# EAGLE board MotherboardRev2 (EAGLE 7.2.0)
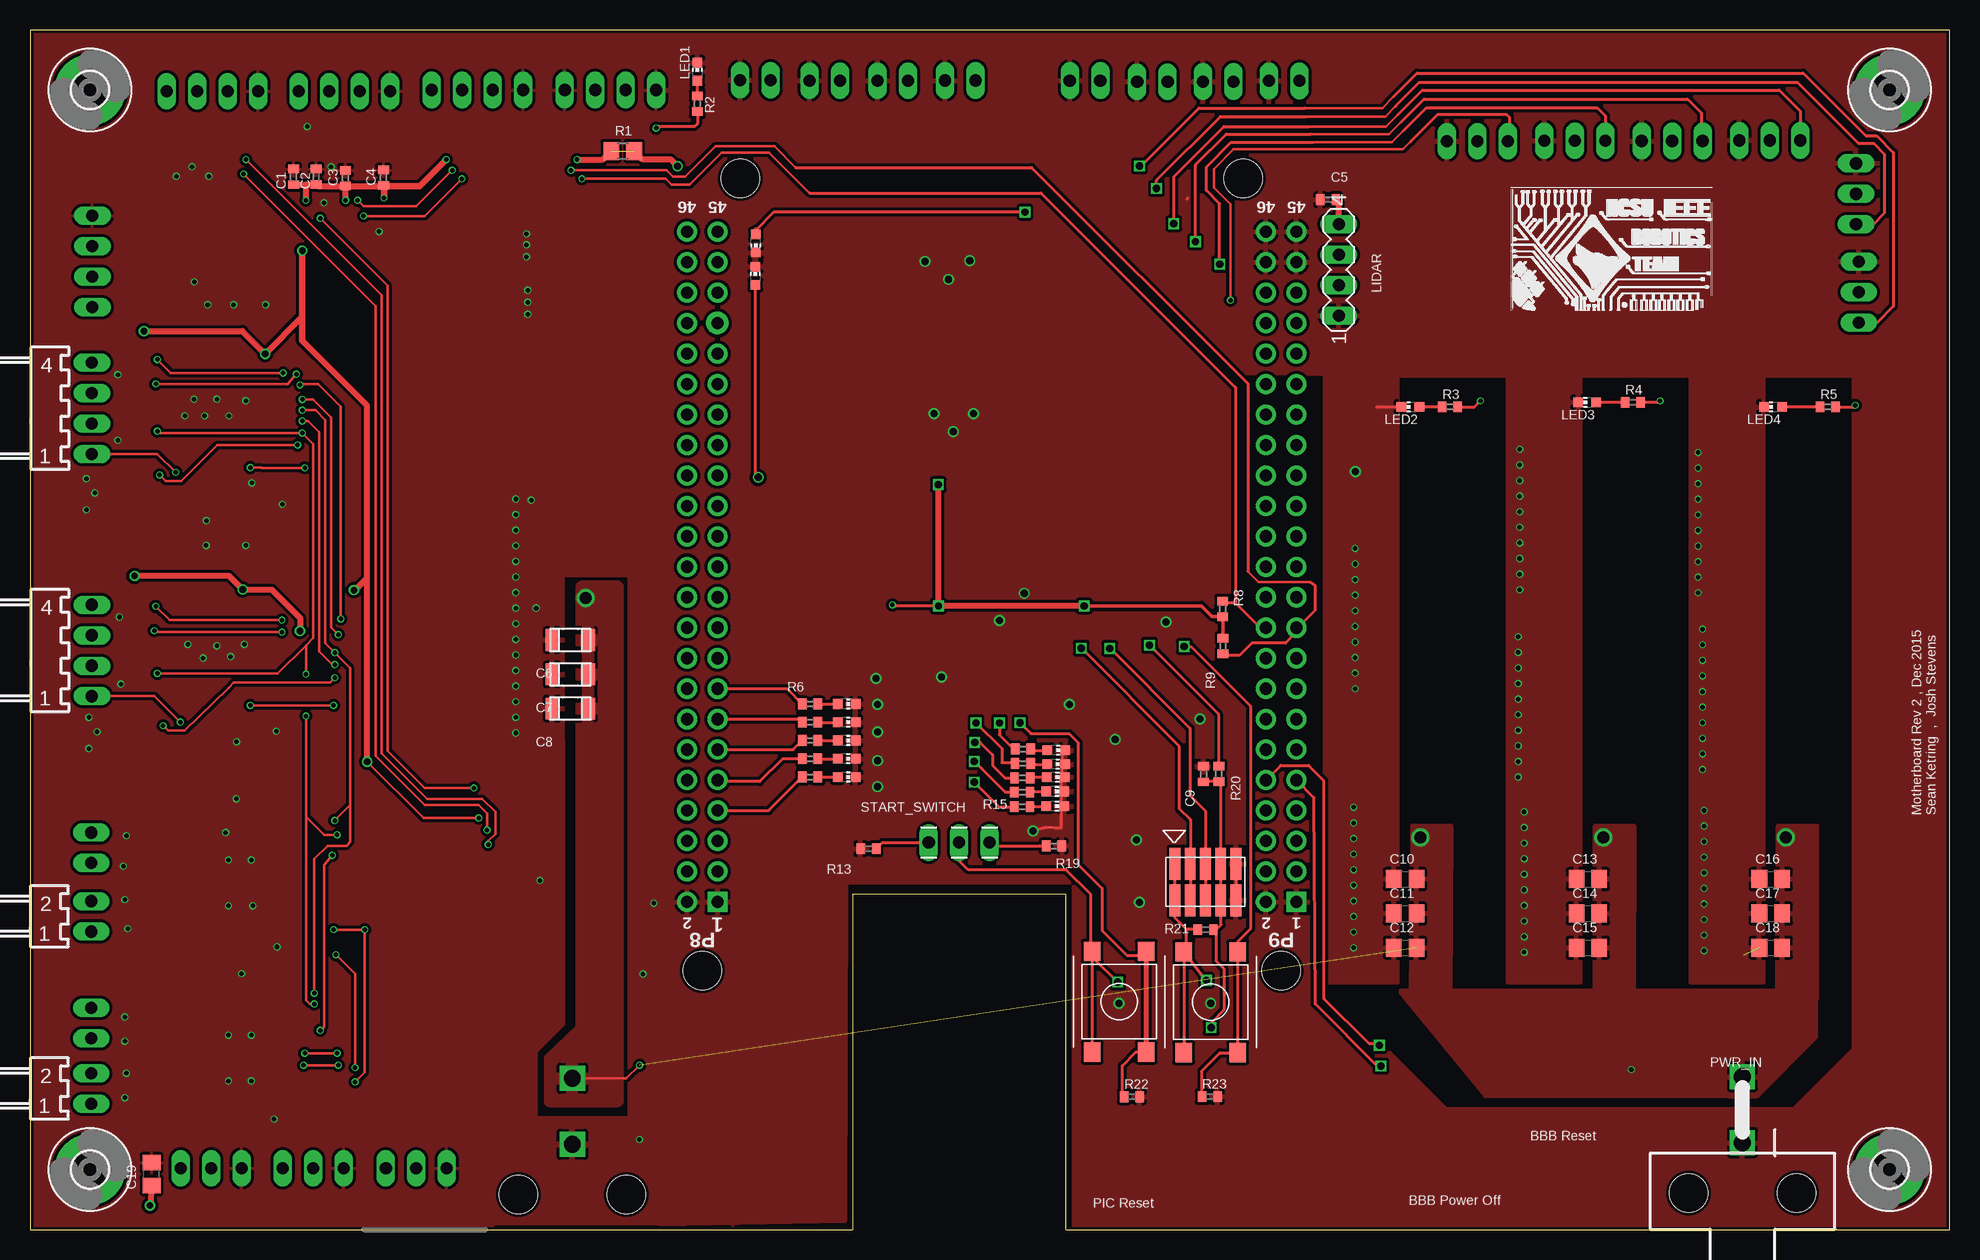
[diagram p12: board, top side]
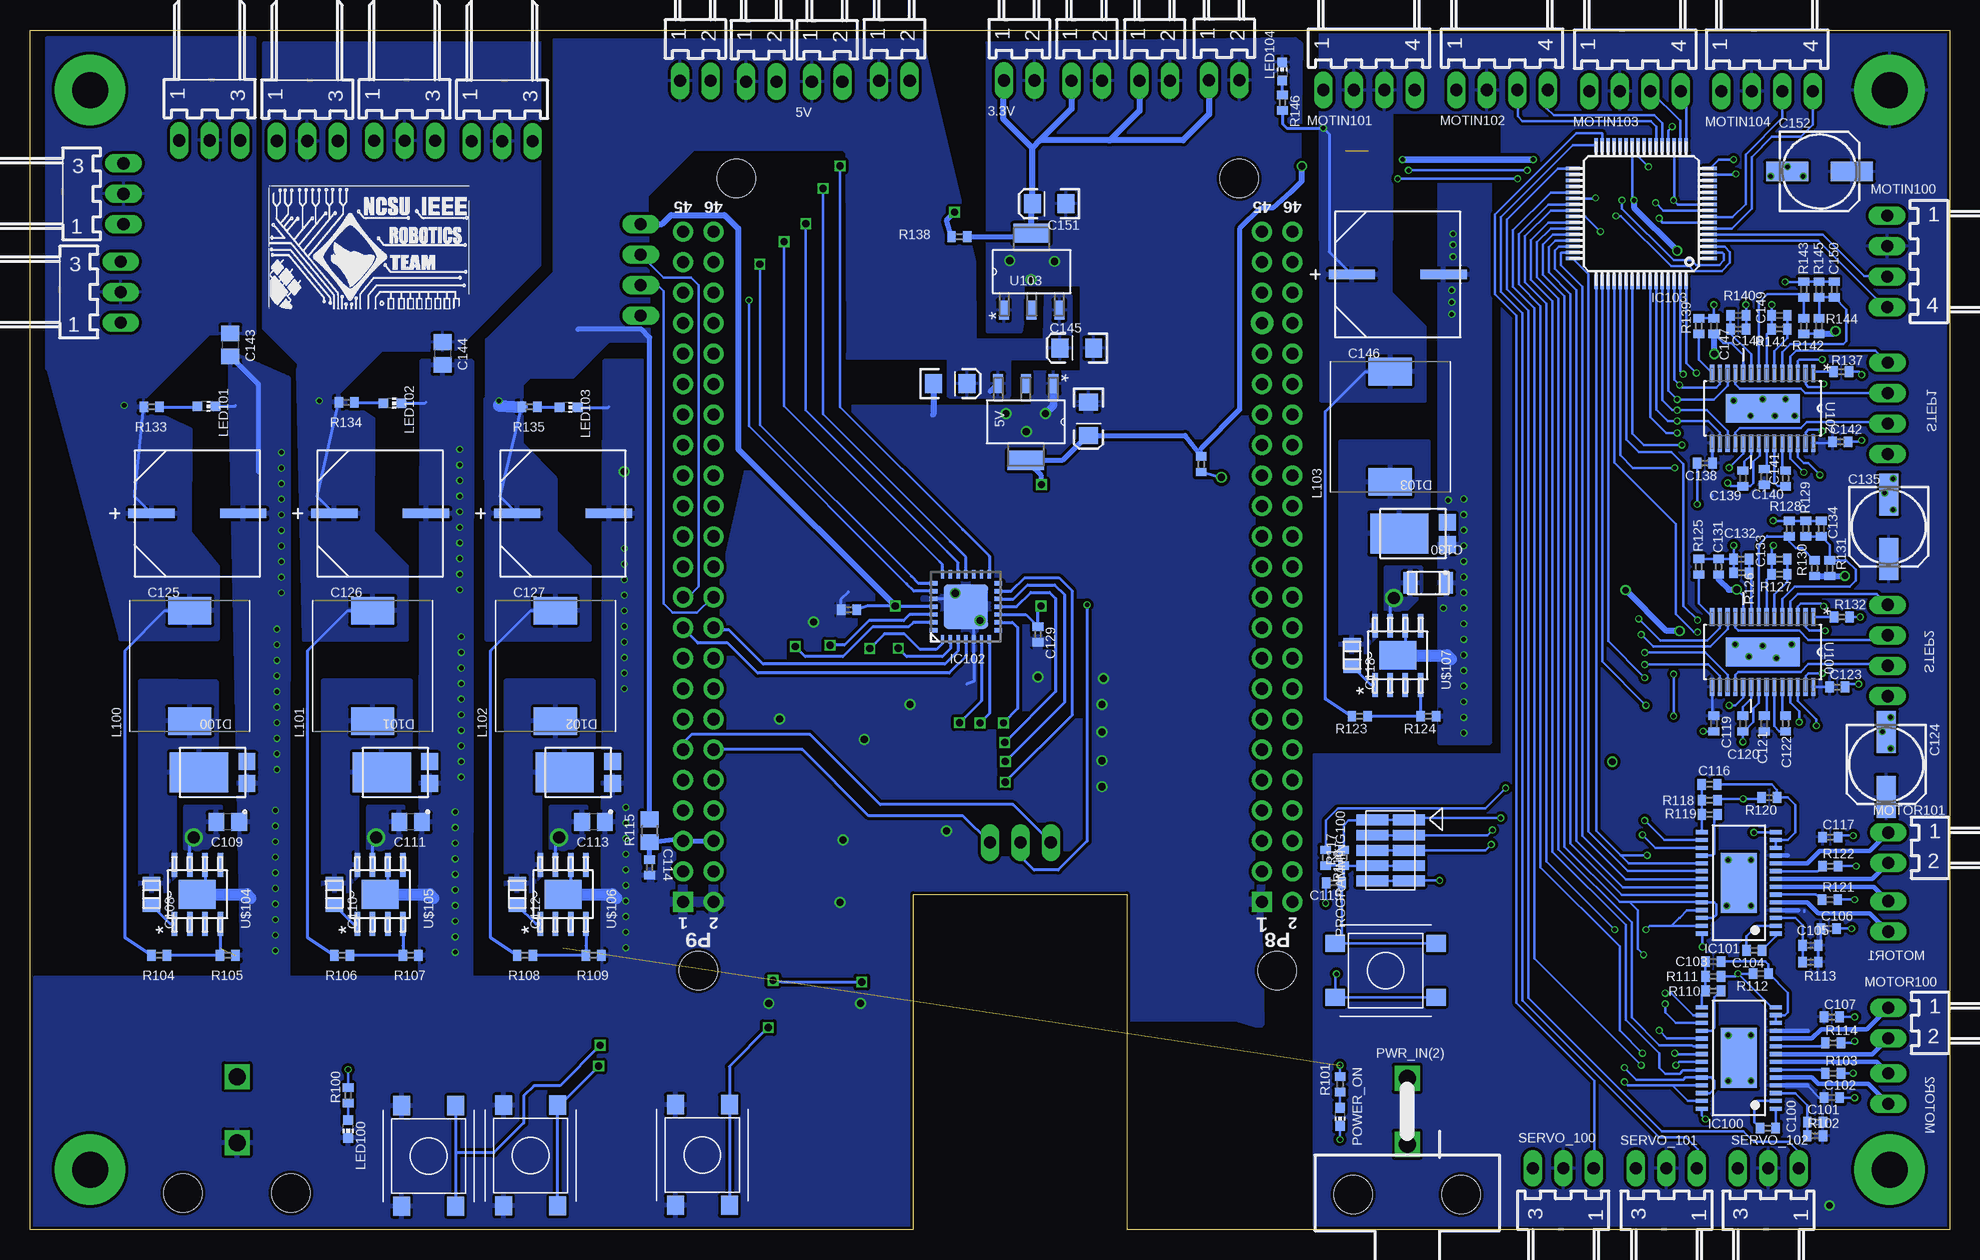
[diagram p13: board, bottom side, seen from below]

Size 160 x 100 mm. Coordinates in mm from the lower left corner, seen from the top.
Outline: 86.36,0 160,0 160,100 0,100 0,0 68.58,0 68.58,27.94 86.36,27.94 86.36,0
Copper layers (1*16): Top 0.035mm / dielectric 1.5mm / Bottom 0.035mm
Design rules "EagleRules-2-Layer-Shep *": minimum track width 6mil, minimum drill 12mil, track to track 6mil, track to pad 6mil, pad to pad 6mil, via to via 6mil, smd to smd 0mil, copper to edge 10mil, drill to drill 10mil, minimum pad ring 2mil, minimum via ring 2mil, stop-mask expansion 2mil, vias tented up to drill 100mil, thermal gap 10mil
Net classes: 0 default: width 0.203 mm, drill 0.33 mm, clearance 0.254 mm; 1 +3v3: width 0.406 mm, drill 0.457 mm, clearance 0.254 mm; 2 VM: width 0.508 mm, drill 0.533 mm, clearance 0.254 mm

## Footprints (pad centres in the part's own frame; a part is rotated, then mirrored left to right if it is on the bottom)
7395-02 = drill 1.016 long: 1 1.27,0; 2 -1.27,0
C0402 = smd 0.7 x 0.9: 1 -0.65,0; 2 0.65,0
1206 = smd 1.118 x 1.803: 1 -1.499,0; 2 1.499,0
C0805 = smd 1.3 x 1.5: 1 -0.95,0; 2 0.95,0
0805 = smd 1.118 x 1.448: 1 -0.902,0; 2 0.902,0
153CLV-0605 = smd 3.5 x 1.6: + 2.7,0; - -2.7,0
SM_RADIAL_10AMM = smd 3.861 x 0.787: 1 -3.823,0; 2 3.823,0
EIA3216 = smd 1.4 x 1.6: A 1.4,0; C -1.4,0
CHIP-LED0603 = smd 0.8 x 0.8: A 0,-0.75; C 0,0.75
POWERDI5 = smd 1.397 x 1.397: 1 -0.92,-2.857; 2 0.92,-2.857 | smd 3.353 x 4.851: 3 0,1.13
3,0-PAD = drill 3 pad 5.842: B3,0 0,0
TSSOP-28 = smd 0.35 x 1: 1 -4.225,-3.087; 2 -3.575,-3.087; 3 -2.925,-3.087; 4 -2.275,-3.087; 5 -1.625,-3.087; 6 -0.975,-3.087; 7 -0.325,-3.087; 8 0.325,-3.087; 9 0.975,-3.087; 10 1.625,-3.087; 11 2.275,-3.087; 12 2.925,-3.087; 13 3.575,-3.087; 14 4.225,-3.087; 15 4.225,3.087; 16 3.575,3.087; 17 2.925,3.087; 18 2.275,3.087; 19 1.625,3.087; 20 0.975,3.087; 21 0.325,3.087; 22 -0.325,3.087; 23 -0.975,3.087; 24 -1.625,3.087; 25 -2.275,3.087; 26 -2.925,3.087; 27 -3.575,3.087; 28 -4.225,3.087 | smd 5 x 3: EXP 0,0
QFN28-ML_6X6MM = smd 0.7 x 0.35: 1 -2.7,1.95; 2 -2.7,1.3; 3 -2.7,0.65; 4 -2.7,0; 5 -2.7,-0.65; 6 -2.7,-1.3; 7 -2.7,-1.95; 15 2.7,-1.95; 16 2.7,-1.3; 17 2.7,-0.65; 18 2.7,0; 19 2.7,0.65; 20 2.7,1.3; 21 2.7,1.95 | smd 0.35 x 0.7: 8 -1.95,-2.7; 9 -1.3,-2.7; 10 -0.65,-2.7; 11 0,-2.7; 12 0.65,-2.7; 13 1.3,-2.7; 14 1.95,-2.7; 22 1.95,2.7; 23 1.3,2.7; 24 0.65,2.7; 25 0,2.7; 26 -0.65,2.7; 27 -1.3,2.7; 28 -1.95,2.7 | smd 3.7 x 3.7: EXP 0,0
TQFP64-10X10 = smd 1.2 x 0.3: 1 -5.7,3.75; 2 -5.7,3.25; 3 -5.7,2.75; 4 -5.7,2.25; 5 -5.7,1.75; 6 -5.7,1.25; 7 -5.7,0.75; 8 -5.7,0.25; 9 -5.7,-0.25; 10 -5.7,-0.75; 11 -5.7,-1.25; 12 -5.7,-1.75; 13 -5.7,-2.25; 14 -5.7,-2.75; 15 -5.7,-3.25; 16 -5.7,-3.75; 33 5.7,-3.75; 34 5.7,-3.25; 35 5.7,-2.75; 36 5.7,-2.25; 37 5.7,-1.75; 38 5.7,-1.25; 39 5.7,-0.75; 40 5.7,-0.25; 41 5.7,0.25; 42 5.7,0.75; 43 5.7,1.25; 44 5.7,1.75; 45 5.7,2.25; 46 5.7,2.75; 47 5.7,3.25; 48 5.7,3.75 | smd 0.3 x 1.2: 17 -3.75,-5.7; 18 -3.25,-5.7; 19 -2.75,-5.7; 20 -2.25,-5.7; 21 -1.75,-5.7; 22 -1.25,-5.7; 23 -0.75,-5.7; 24 -0.25,-5.7; 25 0.25,-5.7; 26 0.75,-5.7; 27 1.25,-5.7; 28 1.75,-5.7; 29 2.25,-5.7; 30 2.75,-5.7; 31 3.25,-5.7; 32 3.75,-5.7; 49 3.75,5.7; 50 3.25,5.7; 51 2.75,5.7; 52 2.25,5.7; 53 1.75,5.7; 54 1.25,5.7; 55 0.75,5.7; 56 0.25,5.7; 57 -0.25,5.7; 58 -0.75,5.7; 59 -1.25,5.7; 60 -1.75,5.7; 61 -2.25,5.7; 62 -2.75,5.7; 63 -3.25,5.7; 64 -3.75,5.7
WE-HCC_1090 = smd 2.3 x 3.6: 1 -4.6,0; 2 4.6,0
MA04-1 = drill 1.016 long: 1 -3.81,0; 2 -1.27,0; 3 1.27,0; 4 3.81,0
7395-04 = drill 1.016 long: 1 3.81,0; 2 1.27,0; 3 -1.27,0; 4 -3.81,0
MOTHER-BOARD-REV5_10-PIN-SMD = smd 0.889 x 2.667: 1 -2.54,1.524; 2 -2.54,-1.524; 3 -1.27,1.524; 4 -1.27,-1.524; 5 0,1.524; 6 0,-1.524; 7 1.27,1.524; 8 1.27,-1.524; 9 2.54,1.524; 10 2.54,-1.524
5569-2 = drill 1.4 square: 1 0,0; 2 0,5.5 | hole 3.2: 4.5,-4.2; -4.5,-4.2
R0805 = smd 1.3 x 1.5: 1 -0.95,0; 2 0.95,0
R0402 = smd 0.7 x 0.9: 1 -0.65,0; 2 0.65,0
7395-03 = drill 1.016 long: 1 2.54,0; 2 0,0; 3 -2.54,0
MA03-1 = drill 1.016 long: 1 -2.54,0; 2 0,0; 3 2.54,0
SOP65P640X120-29N = smd 1.473 x 0.356: 1 -2.921,4.216; 2 -2.921,3.581; 3 -2.921,2.921; 4 -2.921,2.286; 5 -2.921,1.626; 6 -2.921,0.965; 7 -2.921,0.33; 8 -2.921,-0.33; 9 -2.921,-0.965; 10 -2.921,-1.626; 11 -2.921,-2.286; 12 -2.921,-2.921; 13 -2.921,-3.581; 14 -2.921,-4.216; 15 2.921,-4.216; 16 2.921,-3.581; 17 2.921,-2.921; 18 2.921,-2.286; 19 2.921,-1.626; 20 2.921,-0.965; 21 2.921,-0.33; 22 2.921,0.33; 23 2.921,0.965; 24 2.921,1.626; 25 2.921,2.286; 26 2.921,2.921; 27 2.921,3.581; 28 2.921,4.216 | smd 2.388 x 6.172: 29 0,0
SOT230P696X180-4N = smd 1.6 x 0.838: 1 -3.2,2.311; 2 -3.2,0; 3 -3.2,-2.311 | smd 1.6 x 3.023: 4 3.2,0
MC32882_FINAL = smd 1.6 x 1.4: P$1 -4.2,-2.25; P$2 -4.2,2.25; P$3 4.2,2.25; P$4 4.2,-2.25
BEAGLE_BONE_BLACK_CAPE = drill 1.016 pad 1.676 square: P8.1 20.32,50.165; P9.1 20.32,1.905 | drill 1.016 pad 1.676: P8.2 20.32,52.705; P8.3 22.86,50.165; P8.4 22.86,52.705; P8.5 25.4,50.165; P8.6 25.4,52.705; P8.7 27.94,50.165; P8.8 27.94,52.705; P8.9 30.48,50.165; P8.10 30.48,52.705; P8.11 33.02,50.165; P8.12 33.02,52.705; P8.13 35.56,50.165; P8.14 35.56,52.705; P8.15 38.1,50.165; P8.16 38.1,52.705; P8.17 40.64,50.165; P8.18 40.64,52.705; P8.19 43.18,50.165; P8.20 43.18,52.705; P8.21 45.72,50.165; P8.22 45.72,52.705; P8.23 48.26,50.165; P8.24 48.26,52.705; P8.25 50.8,50.165; P8.26 50.8,52.705; P8.27 53.34,50.165; P8.28 53.34,52.705; P8.29 55.88,50.165; P8.30 55.88,52.705; P8.31 58.42,50.165; P8.32 58.42,52.705; P8.33 60.96,50.165; P8.34 60.96,52.705; P8.35 63.5,50.165; P8.36 63.5,52.705; P8.37 66.04,50.165; P8.38 66.04,52.705; P8.40 68.58,52.705; P8.41 71.12,50.165; P8.42 71.12,52.705; P8.43 73.66,50.165; P8.44 73.66,52.705; P8.45 76.2,50.165; P8.46 76.2,52.705; P9.2 20.32,4.445; P9.3 22.86,1.905; P9.4 22.86,4.445; P9.5 25.4,1.905; P9.6 25.4,4.445; P9.7 27.94,1.905; P9.8 27.94,4.445; P9.9 30.48,1.905; P9.10 30.48,4.445; P9.11 33.02,1.905; P9.12 33.02,4.445; P9.13 35.56,1.905; P9.14 35.56,4.445; P9.15 38.1,1.905; P9.16 38.1,4.445; P9.17 40.64,1.905; P9.18 40.64,4.445; P9.19 43.18,1.905; P9.20 43.18,4.445; P9.21 45.72,1.905; P9.22 45.72,4.445; P9.23 48.26,1.905; P9.24 48.26,4.445; P9.25 50.8,1.905; P9.26 50.8,4.445; P9.27 53.34,1.905; P9.28 53.34,4.445; P9.29 55.88,1.905; P9.30 55.88,4.445; P9.31 58.42,1.905; P9.32 58.42,4.445; P9.33 60.96,1.905; P9.34 60.96,4.445; P9.35 63.5,1.905; P9.36 63.5,4.445; P9.37 66.04,1.905; P9.38 66.04,4.445; P9.39 68.58,1.905; P9.40 68.58,4.445; P9.41 71.12,1.905; P9.42 71.12,4.445; P9.43 73.66,1.905; P9.44 73.66,4.445; P9.45 76.2,1.905; P9.46 76.2,4.445 | drill 1.016 pad 1.88: P8.39 68.58,50.165 | hole 3.175: 14.605,3.175; 80.645,6.35; 80.645,48.26; 14.605,51.435
R-PDSO-G8 = smd 1.981 x 0.457: 1 -2.464,1.905; 2 -2.464,0.635; 3 -2.464,-0.635; 4 -2.464,-1.905; 5 2.464,-1.905; 6 2.464,-0.635; 7 2.464,0.635; 8 2.464,1.905 | smd 2.388 x 3.099: 9 0,0

## Placement (x,y rotation side)
3.3V  [7395-02]  77.54,95.79 180 bottom
3.3V1  [7395-02]  66.25,95.77 180 bottom
3.3V(2)  [7395-02]  71.91,95.77 180 bottom
3.3V(2)1  [7395-02]  60.45,95.81 180 bottom
5V  [7395-02]  93.56,95.68 180 bottom
5V1  [7395-02]  99.04,95.7 180 bottom
5V(2)  [7395-02]  87.94,95.78 180 bottom
5V(2)1  [7395-02]  104.53,95.76 180 bottom
C1  0.1uF  [C0402]  21.97,87.76 90 top
C2  0.1uF  [C0402]  23.86,87.76 90 top
C3  1uF  [C0402]  26.3,87.65 90 top
C4  0.1uF  [C0402]  29.47,87.68 90 top
C5  4.7uF  [C0402]  108.2,85.85 180 top
C6  4.7uF  [1206]  45.04,49.14 0 top
C7  4.7uF  [1206]  45.04,46.28 0 top
C8  4.7uF  [1206]  45.04,43.42 0 top
C9  .1uF  [C0402]  97.82,37.96 90 top
C10  4.7uF  [C0805]  114.62,29.21 0 top
C11  4.7uF  [C0805]  114.62,26.35 0 top
C12  4.7uF  [C0805]  114.62,23.5 0 top
C13  4.7uF  [C0805]  129.86,29.21 0 top
C14  4.7uF  [C0805]  129.86,26.35 0 top
C15  4.7uF  [C0805]  129.86,23.5 0 top
C16  4.7uF  [C0805]  145.1,29.21 0 top
C17  4.7uF  [C0805]  145.1,26.35 0 top
C18  4.7uF  [C0805]  145.1,23.5 0 top
C19  10uF  [C0805]  10.13,4.63 90 top
C100  0.01uF  [C0402]  15.14,8.45 180 bottom
C101  0.1uF  [C0402]  11.2,8.96 0 bottom
C102  0.01uF  [C0402]  9.81,10.99 0 bottom
C103  0.47uF  [C0402]  19.7,21.1 0 bottom
C104  0.01uF  [C0402]  16.28,23.28 180 bottom
C105  0.1uF  [C0402]  11.58,23.69 0 bottom
C106  0.01uF  [C0402]  10.06,25.09 0 bottom
C107  0.01uF  [C0402]  9.81,17.72 0 bottom
C108  10nF  [0805]  149.86,27.94 90 bottom
C109  4.7uF  [C0805]  143.51,33.97 180 bottom
C110  10nF  [0805]  134.62,27.94 90 bottom
C111  4.7uF  [C0805]  128.27,33.97 180 bottom
C112  10nF  [0805]  119.38,27.94 90 bottom
C113  4.7uF  [C0805]  113.03,33.97 180 bottom
C114  .1uF  [C0402]  108.35,30.18 270 bottom
C115  .1uF  [C0402]  51.3,28.9 180 bottom
C116  0.47uF  [C0402]  20,35.8 0 bottom
C117  0.01uF  [C0402]  9.93,32.71 0 bottom
C118  10nF  [0805]  49.8,47.87 90 bottom
C119  0.1uF  [C0402]  19.64,42.17 270 bottom
C120  0.22uF  [C0402]  17.22,42.17 270 bottom
C121  0.22uF  [C0402]  15.45,42.17 90 bottom
C122  0.22uF  [C0402]  13.67,42.17 90 bottom
C123  0.1uF  [C0402]  9.35,45.22 0 bottom
C124  100uf  [153CLV-0605]  5.27,38.76 270 bottom
C125  330uF  [SM_RADIAL_10AMM]  146.05,59.69 0 bottom
C126  330uF  [SM_RADIAL_10AMM]  130.81,59.69 0 bottom
C127  330uF  [SM_RADIAL_10AMM]  115.57,59.69 0 bottom
C128  .1uF  [C0402]  91.73,51.67 180 bottom
C129  .1uF  [C0402]  75.98,49.61 270 bottom
C130  4.7uF  [1206]  43.45,53.9 180 bottom
C131  0.1uF  [C0402]  19.25,55.26 90 bottom
C132  1nF  [C0402]  17.35,55.89 180 bottom
C133  1nF  [C0402]  14.18,55.89 180 bottom
C134  .1uF  [C0402]  10.69,58.43 90 bottom
C135  100uf  [153CLV-0605]  5.06,58.58 270 bottom
C136  10uF  [EIA3216]  83.29,70.51 0 bottom
C137  10uF  [EIA3216]  71.77,67.59 270 bottom
C138  0.1uF  [C0402]  20.4,63.89 180 bottom
C139  0.22uF  [C0402]  17.22,62.62 270 bottom
C140  0.22uF  [C0402]  15.45,62.75 90 bottom
C141  0.22uF  [C0402]  13.67,62.62 90 bottom
C142  0.1uF  [C0402]  9.1,65.67 0 bottom
C143  10uF  [C0805]  143.31,73.76 270 bottom
C144  10uF  [C0805]  125.61,73.03 270 bottom
C145  10uF  [EIA3216]  72.74,73.49 180 bottom
C146  330uF  [SM_RADIAL_10AMM]  45.99,79.62 0 bottom
C147  0.1uF  [C0402]  19.64,75.32 90 bottom
C148  1nF  [C0402]  17.6,75.07 0 bottom
C149  1nF  [C0402]  14.18,76.21 180 bottom
C150  0.1uF  [C0402]  9.6,78.37 90 bottom
C151  10uF  [EIA3216]  75.05,85.52 180 bottom
C152  100uf  [153CLV-0605]  10.84,88.2 0 bottom
D1  3_3V_PWR  [CHIP-LED0603]  60.5,82.19 180 top
D2  3_3V_PWR  [CHIP-LED0603]  60.45,79.5 0 top
D100  PDS760-13  [POWERDI5]  144.78,38.1 90 bottom
D101  PDS760-13  [POWERDI5]  129.54,38.1 90 bottom
D102  PDS760-13  [POWERDI5]  114.3,38.1 90 bottom
D103  PDS760-13  [POWERDI5]  44.72,58.03 90 bottom
H1  MOUNT-PAD-ROUND3.0  [3,0-PAD]  5,95 0 top
H2  MOUNT-PAD-ROUND3.0  [3,0-PAD]  155,95 0 top
H3  MOUNT-PAD-ROUND3.0  [3,0-PAD]  5,5 0 top
H4  MOUNT-PAD-ROUND3.0  [3,0-PAD]  155,5 0 top
IC100  DRV8814  [TSSOP-28]  17.55,14.29 90 bottom
IC101  DRV8814  [TSSOP-28]  17.55,28.9 90 bottom
IC102  PIC24FJ64GB202  [QFN28-ML_6X6MM]  81.99,51.92 90 bottom
IC103  PIC24FJ256GB106  [TQFP64-10X10]  25.7,84.7 180 bottom
L100  [WE-HCC_1090]  146.69,46.99 90 bottom
L101  [WE-HCC_1090]  131.44,46.99 90 bottom
L102  [WE-HCC_1090]  116.2,46.99 90 bottom
L103  [WE-HCC_1090]  46.62,66.92 90 bottom
LED1  [CHIP-LED0603]  55.63,96.52 0 top
LED2  [CHIP-LED0603]  115.06,68.58 90 top
LED3  [CHIP-LED0603]  129.79,68.96 90 top
LED4  [CHIP-LED0603]  145.29,68.58 90 top
LED5  [CHIP-LED0603]  68.07,43.81 270 top
LED6  [CHIP-LED0603]  68.07,42.29 270 top
LED7  [CHIP-LED0603]  68.07,40.77 270 top
LED8  [CHIP-LED0603]  68.07,39.24 270 top
LED9  [CHIP-LED0603]  68.07,37.72 270 top
LED10  [CHIP-LED0603]  85.46,35.28 270 top
LED11  [CHIP-LED0603]  85.46,36.52 270 top
LED12  [CHIP-LED0603]  85.5,37.71 270 top
LED13  [CHIP-LED0603]  85.53,38.79 270 top
LED14  [CHIP-LED0603]  85.56,39.96 270 top
LED100  [CHIP-LED0603]  133.48,8.38 180 bottom
LED101  [CHIP-LED0603]  145.28,68.63 270 bottom
LED102  [CHIP-LED0603]  129.79,68.89 270 bottom
LED103  [CHIP-LED0603]  115.1,68.54 270 bottom
LED104  [CHIP-LED0603]  55.62,96.56 0 bottom
LIDAR  [MA04-1]  109.09,80.01 90 top
MOTIN100  22-05-7048-04  [7395-04]  5.2,80.7 90 bottom
MOTIN101  22-05-7048-04  [7395-04]  48.39,95 180 bottom
MOTIN102  22-05-7048-04  [7395-04]  37.3,95 180 bottom
MOTIN103  22-05-7048-04  [7395-04]  26.2,94.9 180 bottom
MOTIN104  22-05-7048-04  [7395-04]  15.2,94.9 180 bottom
MOTOR1  22-05-7028-02  [7395-02]  5.11,26.11 270 top
MOTOR2  22-05-7028-02  [7395-02]  5.11,11.75 270 top
MOTOR100  22-05-7028-02  [7395-02]  5.11,17.21 90 bottom
MOTOR101  22-05-7028-02  [7395-02]  5.11,31.82 90 bottom
POWER_ON  [CHIP-LED0603]  50.8,9.4 180 bottom
PROGRAMMING  Jtag  [MOTHER-BOARD-REV5_10-PIN-SMD]  97.98,28.97 0 top
PROGRAMMING100  Jtag  [MOTHER-BOARD-REV5_10-PIN-SMD]  46.6,31.6 270 bottom
PWR_IN  [5569-2]  142.74,7.24 0 top
PWR_IN(2)  [5569-2]  45.2,7.1 0 bottom
R1  0  [R0805]  49.4,89.92 0 top
R2  10k  [R0402]  55.63,93.85 270 top
R3  10k  [R0402]  118.36,68.58 0 top
R4  10k  [R0402]  133.6,68.96 0 top
R5  10k  [R0402]  149.86,68.58 0 top
R6  1K  [R0402]  65.02,43.81 180 top
R7  1K  [R0402]  65.02,42.29 180 top
R8  4.7K  [R0402]  99.41,51.74 270 top
R9  4.7K  [R0402]  99.44,48.64 90 top
R10  1K  [R0402]  65.02,40.77 180 top
R11  1K  [R0402]  65.02,39.24 180 top
R12  1K  [R0402]  65.02,37.72 180 top
R13  10K  [R0402]  69.89,31.75 0 top
R14  330  [R0402]  82.7,36.46 180 top
R15  330  [R0402]  82.71,35.25 180 top
R16  330  [R0402]  82.71,37.65 180 top
R17  330  [R0402]  82.76,38.86 180 top
R18  330  [R0402]  82.77,40.05 180 top
R19  10K  [R0402]  85.35,31.97 180 top
R20  100  [R0402]  99.1,37.98 270 top
R21  10k  [R0402]  98,25 180 top
R22  10K  [R0402]  91.85,11.07 0 top
R23  10K  [R0402]  98.34,11.09 0 top
R100  10k  [R0402]  133.48,11.18 90 bottom
R101  10k  [R0402]  50.8,12.1 90 bottom
R102  1M  [R0402]  11.2,7.82 0 bottom
R103  0.2  [R0402]  9.71,13.02 0 bottom
R104  10k  [R0402]  149.22,22.86 180 bottom
R105  2.55k  [R0402]  143.51,22.86 180 bottom
R106  10k  [R0402]  133.99,22.86 180 bottom
R107  2.55k  [R0402]  128.27,22.86 180 bottom
R108  10k  [R0402]  118.75,22.86 180 bottom
R109  3.23K  [R0402]  113.03,22.86 180 bottom
R110  10k  [R0402]  19.7,19.9 180 bottom
R111  10k  [R0402]  19.69,22.34 180 bottom
R112  30k  [R0402]  15.73,21.34 180 bottom
R113  1M  [R0402]  11.58,22.3 0 bottom
R114  0.2  [R0402]  9.71,15.56 0 bottom
R115  0 ohm  [R0805]  108.34,33.24 90 bottom
R116  100  [R0402]  52,31 270 bottom
R117  10k  [R0402]  50.5,31 90 bottom
R118  10k  [R0402]  20,37.11 180 bottom
R119  10k  [R0402]  20,34.6 180 bottom
R120  30k  [R0402]  15.01,36.01 180 bottom
R121  0.2  [R0402]  9.96,27.5 0 bottom
R122  0.2  [R0402]  9.93,30.3 0 bottom
R123  10k  [R0402]  49.16,42.79 180 bottom
R124  2.55k  [R0402]  43.45,42.79 180 bottom
R125  0.1  [R0402]  20.91,55.26 90 bottom
R126  47k  [R0402]  17.35,54.75 180 bottom
R127  47k  [R0402]  14.18,54.62 180 bottom
R128  10k  [R0402]  13.35,58.43 90 bottom
R129  10k  [R0402]  11.98,58.43 90 bottom
R130  10k  [R0402]  11.25,55.13 90 bottom
R131  10k  [R0402]  9.98,55.13 90 bottom
R132  0.1  [R0402]  8.97,51.06 0 bottom
R133  10k  [R0402]  149.86,68.58 180 bottom
R134  10k  [R0402]  133.6,68.96 180 bottom
R135  10k  [R0402]  118.36,68.58 180 bottom
R136  330  [R0402]  62.37,63.79 270 bottom
R137  0.1  [R0402]  9.02,71.51 0 bottom
R138  330  [R0402]  82.54,82.76 180 bottom
R139  0.1  [R0402]  20.91,75.32 90 bottom
R140  47k  [R0402]  17.6,76.21 0 bottom
R141  47k  [R0402]  14.18,75.07 180 bottom
R142  10k  [R0402]  12.14,75.32 90 bottom
R143  10k  [R0402]  12.14,78.37 90 bottom
R144  10k  [R0402]  10.87,75.32 90 bottom
R145  10k  [R0402]  10.87,78.37 90 bottom
R146  10k  [R0402]  55.6,93.94 270 bottom
SERVO_100  [7395-03]  32.2,5.1 0 bottom
SERVO_101  [7395-03]  23.6,5.1 0 bottom
SERVO_102  [7395-03]  15.1,5.1 0 bottom
SERVO_103  [7395-03]  152.45,78.16 270 bottom
SERVO_104  [7395-03]  152.21,86.34 270 bottom
SERVO_105  [7395-03]  145.03,90.79 180 bottom
SERVO_106  [7395-03]  136.88,90.74 180 bottom
SERVO_107  [7395-03]  128.78,90.76 180 bottom
SERVO_108  [7395-03]  120.65,90.72 180 bottom
START_SWITCH  [MA03-1]  77.45,32.26 0 top
STEP1  22-05-7048-04  [7395-04]  5.16,68.46 270 top
STEP2  22-05-7048-04  [7395-04]  5.16,48.27 270 top
U100  DRV8811PWP  [SOP65P640X120-29N]  15.57,48.14 270 bottom
U101  LMS8117AMP-3.3  [SOT230P696X180-4N]  76.99,67.33 270 bottom
U102  DRV8811PWP  [SOP65P640X120-29N]  15.57,68.46 270 bottom
U103  LMS8117AMP-3.3  [SOT230P696X180-4N]  76.51,79.85 90 bottom
U$1  LOGO  [LOGO]  130.56,80.9 0 top
U$2  LOGO  [LOGO]  130.68,80.9 0 top
U$3  Switch2  [MC32882_FINAL]  90.79,18.99 270 top
U$4  Switch1  [MC32882_FINAL]  98.42,18.94 270 top
U$5  BEAGLE_BONE_BLACK_CAPE  [BEAGLE_BONE_BLACK_CAPE]  107.47,6.99 90 top
U$100  Switch1  [MC32882_FINAL]  126.77,6.13 270 bottom
U$101  Switch1  [MC32882_FINAL]  118.27,6.17 270 bottom
U$102  Switch3  [MC32882_FINAL]  103.95,6.21 270 bottom
U$103  Switch3  [MC32882_FINAL]  47,21.6 0 bottom
U$104  TPS5450DDAR  [R-PDSO-G8]  146.05,27.94 90 bottom
U$105  TPS5450DDAR  [R-PDSO-G8]  130.81,27.94 90 bottom
U$106  TPS5450DDAR  [R-PDSO-G8]  115.57,27.94 90 bottom
U$107  TPS5450DDAR  [R-PDSO-G8]  45.99,47.87 90 bottom
U$108  LOGO  [LOGO]  132.97,81.03 0 bottom

## Tracks (layer width: path | path; a pad name or v marks a point on that pad's centre or on a via)
3.3V  (via drill 0.38, 0.56, 0.6)  (1 unrouted)
  Top 0.203: v28.1,39 32.8,34.3 v37.4,34.3 | C3.1 | 29.5,87 C4.1
  Top 0.254: PROGRAMMING.1 PROGRAMMING.2 95.44,25.96 96.4,25 | U$4.P$1 U$4.P$4 | 88.54,22.5 U$3.P$1 88.43,23.3 88.43,27.93 86.36,30 78.19,30 77.45,30.74 START_SWITCH.2 | 88.54,22.5 U$3.P$4 | 75.65,51.98 v75.72,51.98 71.97,51.98 v71.88,52.07 | R21.2 96.4,25 | U$4.P$1 97.77,21.11 v98.06,20.77 | v90.66,20.63 88.79,22.5 88.54,22.5 | U$4.P$1 96.4,23.37 96.4,25
  Top 0.305: R9.2 99.44,51.06 R8.2 99.39,51.11 98.51,51.11 97.64,51.98 v87.87,51.98
  Top 0.406: 75.72,62.09 v75.7,62.11
  Top 0.508: v87.87,51.98 v75.72,51.98 75.72,62.09 | v9.5,74.9 17.7,74.9 v19.6,73 | v28.1,39 28.1,54.3 | 28.1,54.3 28.1,68.7 23.8,73 | v22.5,49.9 22.5,51 20.15,53.35 v17.73,53.35 16.59,54.49 v8.71,54.49 | v27,53.3 27.1,53.3 28.1,54.3 | C3.1 29.43,86.99 C4.1 | v26.3,85.8 26.25,85.85 26.25,86.95 C3.1 23.97,87 C2.1 22.99,87.11 | 53.64,88.99 v53.98,88.65 53.43,89.2 51.07,89.2 R1.2 | v45.6,89.2 47.74,89.2 R1.1 | C1.1 22.99,87.11 | v23,85.8 23,87.1 22.99,87.11 | LIDAR.4 109.09,85.61 C5.1
  Top 0.559: v34.7,89.2 32.5,87 29.5,87 v29.5,86 | v22.7,81.6 22.7,76.1 | 22.7,76.1 v19.6,73 | 23.8,73 22.7,74.1 22.7,76.1
  Bottom 0.203: U100.10 17.2,52.82 v17.73,53.35 | 10,54.49 R131.1 | U102.10 17.2,72.9 18.2,73.9 18.86,73.9 C147.1 | R117.2 50.5,33.7 50.1,34.1 48.16,34.1 PROGRAMMING100.2 PROGRAMMING100.1 44.92,34.3 v37.4,34.3 | IC103.10 22.65,85.45 v23,85.8 22.95,85.85 IC103.19 | IC103.38 29.55,85.95 v29.5,86 | IC103.26 26.45,85.95 v26.3,85.8 | R142.1 R144.1 | R136.1 62.37,65.14
  Bottom 0.254: IC102.25 87.81,51.92 v87.87,51.98 90.18,51.98 C128.1 | v75.72,51.98 75.98,51.72 C129.1 76.99,51.27 IC102.10 | v98.06,20.77 97.37,20.66 v90.66,20.63 | v71.88,52.07 71.88,32.38 74.3,29.97 76.31,29.97 77.45,31.11 START_SWITCH.2
  Bottom 0.406: v75.7,62.11 75.7,62.84 76.64,63.78 | 76.64,63.78 U101.4 | 76.64,63.78 76.31,64.11 73.95,64.11 71.87,66.19 C137.A 63.71,66.19 R136.1 | 62.37,65.14 59.17,68.34 59.17,83.42 57.44,85.15 56.41,85.15 54.91,86.48 53.98,87.41
  Bottom 0.508: R144.1 9.73,74.67 v9.5,74.9 | v19.6,73 19.6,74.64 C147.1 | v22.5,49.9 23.6,49.9 v27,53.3 | C131.1 19.25,54.2 18.4,53.35 v17.73,53.35 | R130.1 R131.1 9.97,54.49 v8.71,54.49 | v26.3,85.8 26.3,85.2 v22.7,81.6 | 53.98,87.41 v53.98,88.65 | 87.76,52.09 v87.87,51.98 100.97,65.08 100.97,83.44 102.11,84.58 106.55,84.58 107.31,83.82 LIDAR.4
  Bottom 0.559: v34.7,89.2 v45.6,89.2
+7V  (via drill 0.38, 0.56)
  Top 0.254: R2.2 55.63,92.2 55.37,91.95 52.32,91.95 v52.2,91.82
  Top 0.508: C19.1 v10,2
  Bottom 0.203: U100.15 19.79,42.98 C119.1 | U100.28 C123.1 | C106.1 10.71,23.92 C105.2 R113.2 | 11.86,12.02 10.84,10.99 C102.1 | 13.5,31.17 13.49,31.18 | 12.09,26.61 12.09,26.47 | 12.61,26.62 12.6,26.61 | U102.15 19.76,65.52 19.76,63.91 C138.1 | U102.28 10.13,65.54 C142.1 | 19.76,61.21 19.76,61.1
  Bottom 0.254: R123.2 52.02,44.23 52.02,68.19 48.69,71.52 L103.2 | C146.1 50.88,80.69 51.22,81.03 51.69,81.5 51.69,91.31 v52.2,91.82 55.24,91.82 55.6,92.18 R146.2
  Bottom 0.356: IC100.11 11.81,16.57 | IC100.4 11.86,12.02 | IC101.11 13.5,31.17 | IC101.4 12.61,26.62
  pour Bottom: 52.34,69.14 43.77,69.14 43.77,75.17 46.62,78.03 46.62,82.48 52.34,82.48
  pour Bottom: 46.5,82.5 46.5,93.1 37.3,93.1 37.3,39.6 53,39.6 53,0.2 0.1,0.2 0.1,99.8 52.5,99.8 52.5,82.5
BB_PWR_BUTTON  (via drill 0.6)
  Top 0.254: U$5.P9.9 107.04,35.99 107.14,18.81 112.33,13.62 v112.6,13.62
  Bottom 0.254: U$101.P$3 U$101.P$2 115.85,10.37 v112.6,13.62
BB_SYS_RESET  (via drill 0.6)
  Top 0.254: U$5.P9.10 103.05,37.47 104.27,38.69 106.57,38.69 107.83,37.43 107.83,19.24 107.87,19.24 111.65,15.46 112.36,15.46 v112.47,15.35
  Bottom 0.254: U$100.P$2 124.52,6.38 | 124.52,6.38 U$100.P$3 | v112.47,15.35 115.82,12 118,12 118.84,11.16 118.84,8.89 121.35,6.38 124.52,6.38
BOOT1
  Bottom 0.254: U$106.1 117.82,25.48 C112.1
BOOT2
  Bottom 0.254: U$105.1 133.06,25.48 C110.1
BOOT3
  Bottom 0.254: U$104.1 148.3,25.48 C108.1
BOOT_VM
  Bottom 0.254: U$107.1 48.24,45.41 C118.1
CHANNEL_A_1
  Bottom 0.203: IC103.4 10.95,82.45 5.8,77.3 5.61,77.3 MOTIN100.4
CHANNEL_A_2
  Bottom 0.203: IC103.22 24.45,91.95 24.9,92.4 35.6,92.4 36,92.8 36,94.97 MOTIN102.3
CHANNEL_A_3
  Bottom 0.203: IC103.18 22.45,92.42 MOTIN103.3
CHANNEL_A_4
  Bottom 0.203: MOTIN104.3 13.93,92.67 17,89.6 17,85.5 18.1,84.4 19.95,84.4 IC103.8
CHANNEL_B_1
  Bottom 0.203: IC103.5 10.55,82.95 7.1,79.5 5.27,79.5 MOTIN100.3
CHANNEL_B_2
  Bottom 0.203: IC103.21 23.95,92.25 24.6,92.9 33,92.9 33.6,93.5 33.6,94.89 MOTIN102.4
CHANNEL_B_3
  Bottom 0.203: IC103.17 21.95,94.46 MOTIN103.4
CHANNEL_B_4
  Bottom 0.203: MOTIN104.4 11.39,92.11 12.4,91.1 14.8,91.1 16.5,89.4 16.5,85.1 18.15,83.45 IC103.6
GND  (via drill 0.38, 0.6)  (1 unrouted)
  Top 0.254: PROGRAMMING.9 PROGRAMMING.10 | 96.43,85.93 96.5,86 | LED14.C 86.03,39.93 86.03,39.04 LED13.C 86,38.76 86,37.96 LED12.C 85.96,37.67 85.96,36.77 LED11.C 85.96,36.52 85.96,35.53 LED10.C 85.93,35.26 85.93,33.44 84.74,33.52 v83.6,33.23 | LED2.C 112.31,68.58 112.27,68.54
  Bottom 0.203: U100.29 v15.57,48.65 | U100.21 15.9,43.88 16.33,43.44 16.33,42.3 17.11,41.52 C120.2 v17.22,40.65 | R132.2 v7.44,51.06 | C119.2 20.51,41.52 v20.52,41.54 | U100.7 15.24,54.2 R127.2 C133.2 14.82,56.89 v14.68,57.03 | R126.2 C132.2 | C132.2 18,57.02 v17.98,57.03 | C117.2 9.16,32.84 v8.03,32.84 | R122.2 v7.77,30.3 | R121.2 v7.9,27.5 | C106.2 v8.15,25.09 | IC101.EXP 18.44,29.79 v18.44,30.8 | IC101.28 20.6,24.63 v20.6,23.57 | IC100.EXP 17.55,15.31 v18.44,16.2 | v17.63,21.34 17.62,21.32 16.36,21.32 R112.2 | C107.2 v7.9,17.72 | R114.2 8.03,15.56 v7.9,15.69 | R103.2 v8.03,13.02 | C102.2 v7.9,10.99 | U102.7 15.24,74.65 R141.2 C149.2 14.81,76.22 v14.81,77.1 | R137.2 7.57,71.51 v7.32,71.26 | C142.2 7.44,65.67 v7.32,65.8 | U102.21 15.83,65.47 15.83,64.53 16.33,64.02 16.33,62.24 16.6,61.97 C139.2 18.22,61.97 v18.49,62.24 | U102.29 v15.57,69.22 | C148.2 R140.2 16.95,77.08 v16.97,77.1 | v19.64,77.1 C147.2 R139.2 | C123.2 8.45,45.48 v7.57,45.48 | C134.2 R129.2 R128.2 14.68,59.08 v14.7,59.1 | C138.2 21.03,63.88 v21.03,60.46 | R125.2 C131.2 18.02,55.91 C132.2 | C150.2 R145.2 R143.2 12.16,79 v13.7,79 | IC100.28 20.64,9.51 v20.35,9.21 | v42.5,29.1 45.04,29.1 PROGRAMMING100.9 PROGRAMMING100.10 | C115.2 52,28.85 v52,27.2 | U$103.P$4 U$103.P$1 51.2,21.2 v51.1,21.3 | IC103.25 25.95,89.45 v25.1,88.6 | IC103.9 23.85,84.95 v24.5,85.6 | v13.5,88.6 13.3,88.44 C152.- | C135.- 5.28,61.28 v5.4,61.4 | v5.6,41.5 5.3,41.5 C124.- | IC103.41 30.35,84.45 v29.1,83.2 | C103.2 17.87,21.1 v17.63,21.34 | IC100.14 14.82,18.52 v17.63,21.34 | IC101.14 16.28,33.12 v16.3,33.1 | 15.7,35.97 R120.2 15.87,35.8 15.97,35.9 v17.2,35.9 19.25,35.9 C116.2 | POWER_ON.C v50.8,7.5
  Bottom 0.203: IC103.20 23.45,91.61 v23.11,91.95 | 84.71,52.58 IC102.24
  Bottom 0.254: U$106.6 114.94,27.94 | U$105.6 130.18,27.94 | U$104.6 145.41,27.94 | IC102.24 | C128.2 92.42,51.72 92.42,52.52 91.78,53.16 | 81.9,45.47 81.33,45.69 81.34,49.18 IC102.5 81.34,51.92 IC102.EXP | U$107.6 45.35,47.87 | LED102.C 127.07,68.89 127,68.96 | LED103.C 111.8,68.54 111.76,68.58 | LED101.C 142.95,68.63 142.88,68.71 | 84.69,67.97 84.84,67.82 | v82.88,53.05 83.09,53.05 83.57,52.58 84.71,52.58
  Bottom 0.406: C143.2 140.97,70.47 140.97,63.18
  Bottom 0.508: C136.C 84.69,67.97
  Bottom 0.61: U101.1 74.68,68.68 v75.35,68.01
  Bottom 1.016: U$106.9 114.94,27.94 111.44,27.94 111.12,27.62 | U$105.9 130.18,27.94 126.68,27.94 126.36,27.62 | U$104.9 145.41,27.94 141.92,27.94 141.6,27.62 | U$107.9 45.35,47.87 41.86,47.87 41.55,47.55
  other vias: 110.49,63.18 74.6,80.71 76.57,79.21 78.33,80.76 76.95,66.51 78.65,68.01 90.78,18.85 98.41,18.86 97.52,42.57 75.98,46.06 80.81,50.78 13.16,48.78 14.43,47.63 16.71,47.76 17.86,48.78 16.54,30.8 18.57,26.99 16.54,26.99 16.54,16.2 18.44,12.39 16.54,12.39 12.9,67.83 13.67,69.22 14.56,67.83 16.59,67.83 17.98,69.1 12.2,87.8 14.9,87.8 4.7,62.6 4.7,60 4.9,42.7 4.9,40.1 41.38,81.1 41.38,82.1 41.38,83 41.48,78.3 41.48,77.3 41.48,76.3 41.78,60.8 40.48,60.9 40.48,59.6 40.48,58.3 40.48,57 40.48,55.7 40.48,54.4 40.48,53.1 40.48,51.8 42.19,51.8 40.48,50.5 40.48,49.2 40.48,47.9 40.48,46.6 40.48,45.3 40.48,44 40.48,42.7 40.48,41.4 94.69,50.64 110.33,35.19 110.33,33.89 110.33,32.59 110.33,31.29 110.33,29.99 110.33,28.69 110.33,27.39 110.33,26.09 110.33,24.79 110.33,23.49 110.46,56.78 110.46,55.48 110.46,54.18 110.46,52.88 110.46,51.58 110.46,50.28 110.46,48.98 110.46,47.68 110.46,46.38 110.46,45.08 124.56,34.81 124.56,33.51 124.56,32.21 124.56,30.91 124.56,29.61 124.56,28.31 124.56,27.01 124.56,25.71 124.56,24.41 124.56,23.11 124.18,65.04 124.18,63.74 124.18,62.44 124.18,61.14 124.18,59.84 124.18,58.54 124.18,57.24 124.18,55.94 124.18,54.64 124.18,53.34 124.05,49.41 124.05,48.12 124.05,46.81 124.05,45.52 124.05,44.22 124.05,42.91 124.05,41.62 124.05,40.31 124.05,39.02 124.05,37.72 139.54,34.94 139.54,33.64 139.54,32.34 139.54,31.04 139.54,29.74 139.54,28.44 139.54,27.14 139.54,25.84 139.54,24.54 139.54,23.24 139.42,50.05 139.42,48.75 139.42,47.45 139.42,46.15 139.42,44.85 139.42,43.55 139.42,42.25 139.42,40.95 139.42,39.65 139.42,38.35 139.04,64.78 139.04,63.48 139.04,62.18 139.04,60.88 139.04,59.58 139.04,58.28 139.04,56.98 139.04,55.68 139.04,54.38 139.04,53.08 70.52,45.93 70.65,43.77 70.65,41.49 70.65,39.08 70.65,36.92 86.65,43.77 90.46,40.85 92.24,32.47 92.49,27.26
  pour Top: 113.98,20.64 113.98,72.39 107.95,72.39 107.95,20.64
  pour Bottom: 112.24,20 112.08,72.39 107.95,72.39 108.11,20
  pour Top: 129.22,20.64 129.22,72.39 123.19,72.39 123.19,20.64
  pour Bottom: 127.42,20.03 127.32,72.39 123.19,72.39 123.29,20.03
  pour Top: 144.46,20.64 144.46,72.39 138.43,72.39 138.43,20.64
  pour Bottom: 142.25,20.52 143.3,73.1 138.5,71 138.51,20.42
  pour Top: 114.21,71.3 114.21,71.23 159.7,71.23 159.7,99.52 52.7,99.66 52.9,71.91
  pour Bottom: 86.87,0.22 159.55,0.22 159.55,21 86.87,21
  pour Bottom: 57.65,24.81 55.3,68.41 98.93,68.33 110.23,17.91 59.27,17.71 57.48,17.2
  pour Top: 52.48,0.48 67.92,0.76 68,29 87,29 87,0 161,0 161,72 152,72 152,15 147,10 118,10 108,20 108,75 52.75,75.51
  pour Bottom: 77.4,74.8 79.7,74.8 80.19,74.82 80.19,98.83 80.31,98.95 54.58,99.33 54,98.88 54.22,84.5 58.51,84.25 58.53,84.27 58.53,68.32 58.49,68.28 76.27,68.28 76.42,68.43 76.42,71.45 76.34,71.53 72.36,71.53 72.36,78.71 72.38,78.73 77.2,78.73 77.22,78.75 77.27,75.52
  pour Top: 44.4,40.57 44.4,92.32 38.37,92.32 38.37,40.57
  pour Bottom: 42.5,40.57 42.5,92.32 38.37,92.32 38.37,40.57
  pour Top (isolate 0.254): 52.7,0.6 52.7,9.2 42.1,9.2 42.1,14.9 44.4,17.2 44.4,40.6 38.4,40.6 38.4,0.6
  pour Top (isolate 0.254): 53,100 53,9 49.9,9 49.9,54.5 38.6,54.5 38.6,-0.1 0,-0.1 0,100
  pour Top: 58.93,19.43 58.93,0.64 58.55,0.25
GPIO23
  Top 0.254: U$5.P8.13 64.12,42.55 R7.2
GPIO45
  Top 0.254: U$5.P8.11 63.61,40.01 R10.2
GPIO47
  Top 0.254: U$5.P8.15 63.1,45.09 R6.2
GPIO66
  Top 0.254: U$5.P8.7 61.58,34.92 R12.2
GPIO69
  Top 0.254: R11.2 62.74,39.24 60.83,37.34 57.43,37.34 U$5.P8.9
IO3  (via drill 0.6)
  Top 0.254: v80.81,42.24 80.81,41.23 81.99,40.05 R18.2
  Bottom 0.254: IC102.7 80.04,43.01 v80.81,42.24
IO4  (via drill 0.6)
  Top 0.254: v78.86,42.24 v78.87,42.24 81.02,40.09 81.02,38.92 81.95,38.92 R17.2
  Bottom 0.254: IC102.9 78.11,50.62 77.68,50.19 77.68,43.42 v78.86,42.24
IO5  (via drill 0.6)
  Top 0.254: 82.02,37.61 R16.2 81.27,37.65 80.23,38.69 80.23,39.58 79.2,40.61 v78.75,40.61
  Bottom 0.254: IC102.11 77.77,51.92 76.58,53.11 75.02,53.11 74.52,52.61 74.52,44.84 v78.75,40.61
IO6  (via drill 0.6)
  Top 0.254: v78.7,39.02 78.73,39.02 79.3,38.45 79.32,38.45 81.28,36.49 82.02,36.49 R14.2
  Bottom 0.254: IC102.12 78.02,52.57 76.84,53.75 74.6,53.75 73.77,52.92 73.77,43.95 v78.7,39.02
IO7  (via drill 0.6)
  Top 0.254: v78.71,37.3 78.71,37.27 80.76,35.22 82.03,35.22 R15.2
  Bottom 0.254: IC102.13 78.21,53.22 77.08,54.35 74.23,54.35 73.16,53.28 73.16,42.85 v78.71,37.3
M1-AENBL
  Bottom 0.203: IC103.47 32.35,81.45 32.4,81.4 32.4,80.4 30.6,78.6 30.6,32.8 27,29.2 20.66,29.2 IC101.21
M1-APHASE
  Bottom 0.203: 20.68,29.91 IC101.20 20.67,29.9 26.8,29.9 30.1,33.2 30.1,79.65 IC103.48
M1-BENBL
  Bottom 0.203: IC101.22 20.7,28.52 27.22,28.52 31.1,32.4 31.1,78.3 32.9,80.1 32.9,81.6 32.55,81.95 IC103.46
M1-BHPASE
  Bottom 0.203: IC103.45 32.85,82.45 33.4,81.9 33.4,79.8 31.6,78 31.6,32.2 27.3,27.9 20.66,27.9 IC101.23
M1-MAOUT1
  Bottom 0.356: IC101.5 11.84,27.27 10.92,26.36 6.63,26.36 MOTOR1.1
M1-MAOUT2
  Bottom 0.356: IC101.7 6.31,28.57 MOTOR1.2
M1-MBOUT1
  Bottom 0.356: IC101.10 11.86,30.52 10.82,31.57 6.63,31.57 MOTOR101.1
M1-MBOUT2
  Bottom 0.356: IC101.8 6.43,29.22 MOTOR101.2
M2-AENBL  (via drill 0.38)
  Top 0.203: v25.6,14.7 v22.9,14.7
  Bottom 0.203: 20.7,14.68 IC100.21 22.82,14.62 v22.9,14.7 | IC103.39 33.45,85.45 35.9,83 35.9,78.8 34.1,77 34.1,30.2 27.5,23.6 27.5,16.6 v25.6,14.7
M2-APHASE
  Bottom 0.203: 20.68,15.31 IC100.20 | IC103.43 33.25,83.45 34.4,82.3 34.4,79.4 32.6,77.6 32.6,31.7 26.5,25.6 26.5,17.7 24.17,15.37 21.47,15.37 21.37,15.27 IC100.20 | 20.67,15.3 IC100.20
M2-BENBL  (via drill 0.38)
  Top 0.203: v25.7,13.7 v22.8,13.7
  Bottom 0.203: 20.7,13.91 IC100.22 22.53,13.97 v22.8,13.7 | v25.7,13.7 34.6,22.6 34.6,76.8 36.4,78.6 36.4,83.3 33.25,86.45 IC103.37
M2-BHPASE
  Bottom 0.203: IC100.23 20.68,13.28 22.22,13.28 22.5,13 23.7,13 24.2,13.5 24.2,14.7 27,17.5 27,25.4 33.1,31.5 33.1,77.4 34.9,79.2 34.9,82.5 33.45,83.95 IC103.42
M2-MAOUT1
  Bottom 0.356: IC100.5 11.48,12.67 10.95,12.13 6.76,12.13 MOTOR2.1
M2-MAOUT2
  Bottom 0.356: IC100.7 6.05,13.97 MOTOR2.2
M2-MBOUT1
  Bottom 0.356: IC100.10 11.48,15.92 10.7,16.71 6.88,16.71 MOTOR100.1
M2-MBOUT2
  Bottom 0.356: IC100.8 6.43,14.62 MOTOR100.2
M-DECAY  (via drill 0.38)
  Top 0.203: v24.2,16.6 24.5,16.9 24.5,30.4 v25.2,31.2
  Bottom 0.203: IC100.19 20.67,15.95 23.55,15.95 v24.2,16.6 | IC103.49 29.45,33.25 27.4,31.2 | 27.4,31.2 26.72,30.52 IC101.19 | v25.2,31.2 27.4,31.2
M-I0  (via drill 0.38)
  Top 0.203: v27.1,13.5 27.1,21.3 v25.5,22.9
  Bottom 0.203: IC101.26 19.71,25.98 19.46,26.23 19.46,27.12 19.61,27.27 IC101.24 20.67,27.3 26.7,27.3 | IC100.26 19.97,11.37 19.59,11.75 19.59,12.39 19.86,12.67 IC100.24 22.03,12.67 22.2,12.5 26.1,12.5 v27.1,13.5 | IC103.44 33.05,82.95 33.9,82.1 33.9,79.6 32.1,77.8 32.1,31.9 27.5,27.3 26.7,27.3 | v25.5,22.9 26,23.4 26,26.6 26.7,27.3
M-I1  (via drill 0.38)
  Top 0.203: v25.3,25 v27.9,25 27.9,13.1 v27.1,12.3
  Bottom 0.203: 20.65,12.01 IC100.25 23.1,12.02 | IC103.40 33.25,84.95 35.4,82.8 35.4,79 33.6,77.2 33.6,30.7 v27.9,25 | v25.3,25 24.98,25.32 23.2,25.32 | 23.2,25.32 IC101.27 | IC101.25 21.88,26.62 22.5,26 22.52,26 23.2,25.32 | 23.1,12.02 26.82,12.02 v27.1,12.3 | IC100.27 21.8,10.72 23.1,12.02
M-NSLEEP  (via drill 0.38)
  Top 0.203: v10.62,66.56 10.78,66.4 v22.7,66.4 23.6,65.5 23.6,49.3 23,48.7 | v10.62,46.37 20.66,46.37 23,48.7 | v25.6,32.9 24.5,32.9 23,34.4 | 23,34.4 v23,42.8 | v23.7,18.8 23.3,18.8 23,19.1 23,34.4 | v23,46.3 23,48.7
  Bottom 0.203: IC100.17 22.82,17.22 23.7,18.1 v23.7,18.8 | U102.27 11.99,66.46 11.76,66.69 10.75,66.69 v10.62,66.56 | U100.27 11.99,46.14 11.76,46.37 v10.62,46.37 | IC103.58 24.95,67.75 23.6,66.4 v22.7,66.4 | IC101.17 24.52,31.82 v25.6,32.9 | v23,42.8 v23,46.3
M-RESET  (via drill 0.38)
  Top 0.203: v22.7,68.3 23.8,68.3 24.6,67.5 24.6,48.9 v25.4,48.1 26.7,46.8 26.7,35.4 | v25.4,34.1 26.7,35.4 | v23.7,19.7 23.7,30.9 24.8,32 26.4,32 26.7,32.3 26.7,35.4
  Bottom 0.203: U100.17 18.49,46.24 20.36,48.1 v25.4,48.1 | 20.66,17.85 IC100.16 21.37,17.87 23.2,19.7 v23.7,19.7 | U102.17 18.49,66.56 20.23,68.3 v22.7,68.3 23.1,68.3 23.95,69.15 IC103.60 | IC101.16 23.77,32.47 v25.4,34.1
M_MCLR
  Bottom 0.203: R117.1 R116.2 | R117.1 50.5,29.05 C115.1 50.65,24.4 U$103.P$2 U$103.P$3 | PROGRAMMING100.7 PROGRAMMING100.8 50.48,30.33 R117.1
M_MCLR'  (via drill 0.38)
  Top 0.203: v37,36.8 32.9,36.8 29.8,39.9 29.8,78.7 v24.2,84.3
  Bottom 0.203: R116.1 52,34.1 51,35.1 38.7,35.1 v37,36.8 | v24.2,84.3 23.95,83.95 IC103.7
M_PGC1  (via drill 0.38)
  Top 0.203: v38.1,33.3 38.1,34.7 37.4,35.4 32.9,35.4 28.8,39.5 28.8,77 v17.8,88
  Bottom 0.203: PROGRAMMING100.4 PROGRAMMING100.3 38.53,32.87 v38.1,33.3 | v17.8,88 17.85,87.95 IC103.15
M_PGD1  (via drill 0.38)
  Top 0.203: v38.2,32.1 38.2,32.4 38.8,33 38.8,34.8 37.7,35.9 33.1,35.9 29.3,39.7 29.3,77.9 v18,89.2
  Bottom 0.203: PROGRAMMING100.6 PROGRAMMING100.5 38.7,31.6 v38.2,32.1 | v18,89.2 19.25,89.2 IC103.16
MCLR  (via drill 0.6)
  Top 0.254: R21.1 98.88,25 | 98.88,25 99.28,25.4 99.28,27.42 PROGRAMMING.8 PROGRAMMING.7 99.25,37.18 R20.2 97.97,37.34 C9.1 | 98.88,25 98.86,24.98 98.86,22.38 99.51,21.73 99.51,18.3 98.46,17.25 v98.46,16.84
  Bottom 0.254: U$102.P$3 U$102.P$2 101.7,13.6 v98.46,16.84
MCLR'  (via drill 0.6)
  Top 0.254: R20.1 99.1,42.93 v93.32,48.71
  Bottom 0.254: IC102.26 86.67,51.27 87.18,50.76 90.07,50.76 92.12,48.71 v93.32,48.71
N$1
  Bottom 0.254: R135.1 115.89,68.58 LED103.A
N$2
  Bottom 0.254: LED102.A 132.88,68.89 R134.1
N$3
  Bottom 0.254: R133.1 146.2,68.58 LED101.A
N$4
  Bottom 0.203: IC101.2 16.05,25.32 16.93,24.44 C104.2
N$5
  Top 0.254: R15.1 83.39,35.28 LED10.A
N$6
  Top 0.254: R14.1 83.42,36.52 LED11.A
N$7
  Top 0.254: R16.1 83.42,37.71 LED12.A
N$8
  Top 0.254: R17.1 83.38,38.79 LED13.A
N$9
  Top 0.254: R18.1 83.38,39.96 LED14.A
N$10  (via drill 0.6)
  Top 0.254: D2.A 60.45,62.95 v60.7,62.7
  Bottom 0.254: R136.2 60.74,62.74 v60.7,62.7
N$11  (via drill 0.6)
  Top 0.254: v82.93,84.81 61.98,84.81 60.5,83.33
  Top 0.406: D1.A 60.5,83.33
  Bottom 0.406: R138.2 83.59,84.15 v82.93,84.81
N$12
  Bottom 0.203: IC101.1 14.47,24.44 C104.1
N$13
  Bottom 0.203: R113.1 C105.1 12.22,23.71 12.22,25.34 12.85,25.97 IC101.3
N$14
  Bottom 0.203: R121.1 11.13,27.92 IC101.6
N$15
  Bottom 0.203: R122.1 11.01,29.87 IC101.9
N$16
  Bottom 0.203: IC101.12 IC101.13 13.47,32.47 12.85,33.09 12.85,35.38 13.49,36.01 R120.1 14.38,36.03 14.38,36.65 14.83,37.1 18.54,37.1 R118.1
N$17
  Bottom 0.203: IC100.2 16.05,10.72 16.28,10.48 16.28,8.95 C100.2
N$18
  Bottom 0.406: U$5.P9.6 U$5.P9.5 105.77,32.59 R115.1 108.35,32.58 C114.1
N$19
  Bottom 0.203: LED100.A R100.1
N$20
  Bottom 0.203: IC100.1 14.47,8.48 C100.1
N$21
  Bottom 0.203: IC100.3 12.85,11.37 11.84,10.36 11.84,8.47 C101.1 R102.1
N$22
  Bottom 0.203: IC100.6 10.75,13.32 R103.1
N$23
  Bottom 0.203: IC100.9 10.75,15.27 R114.1
N$24
  Bottom 0.203: IC100.12 IC100.13 13.72,17.87 13.49,18.1 13.49,19.75 R112.1 15.09,21.35 15.09,22.1 15.35,22.35 19.04,22.35 R111.1
N$26
  Bottom 0.203: IC101.18 19.73,31.17 19.6,31.3 19.6,34.35 R119.1
N$27
  Bottom 0.203: R139.1 20.91,72.5 U102.14
N$28
  Bottom 0.203: R137.1 11.23,71.51 U102.1
N$29
  Bottom 0.203: R118.2 20.65,37.01 C116.1 R119.2 IC101.15
N$30
  Bottom 0.203: U102.6 14.61,73.24 13.54,74.31 13.54,75.05 R141.1 C149.1
N$32
  Bottom 0.203: U102.9 16.54,72.98 18.25,74.7 C148.1 R140.1
N$33
  Bottom 0.203: U102.5 13.95,73.14 13.29,73.8 8.84,73.8 8.59,74.05 8.59,76.7 C150.1 R145.1 R144.2
N$34
  Bottom 0.203: U102.8 15.9,77.28 15.19,77.99 12.41,77.99 R143.1 | 12.16,77.73 R143.1 | R142.2 R143.1
N$35
  Bottom 0.203: IC100.18 19.83,16.57 19.6,16.8 19.6,19.35 R110.1
N$36
  Bottom 0.203: U102.23 14.61,62.29 14.3,61.99 13.68,61.99 C141.1
N$37
  Bottom 0.203: R111.2 20.34,21.21 C103.1 | 20.34,21.19 C103.1 | IC100.15 20.64,19.61 R110.2 C103.1
N$38
  Bottom 0.203: U102.24 13.95,63.55 C141.2
N$39
  Bottom 0.203: U102.20 16.54,64.58 17.1,64.02 17.1,63.52 C139.1
N$40
  Bottom 0.203: C140.2 15.24,63.6 U102.22
N$41
  Bottom 0.203: U100.14 20.91,52.18 R125.1
N$42
  Bottom 0.203: R132.1 U100.1
N$43
  Bottom 0.203: C133.1 R127.1 13.54,54.6 13.54,53.98 14.61,52.92 U100.6
N$44
  Bottom 0.203: U100.9 16.54,54.58 R126.1 C132.1
N$45
  Bottom 0.203: U100.5 13.95,52.56 12.9,53.6 8.33,53.6 7.83,54.11 7.83,55 8.6,55.78 R131.2 9.98,57.08 C134.1 R129.1
N$46
  Bottom 0.203: U100.8 15.9,57.08 15.19,57.8 15.18,57.78 R128.1 13.35,57.35 12.8,56.8 12.28,56.8 R130.2
N$47
  Bottom 0.203: U100.23 14.61,41.97 14.18,41.54 13.68,41.54 C122.1
N$48
  Bottom 0.203: U100.24 13.95,43.1 C122.2
N$49
  Bottom 0.203: U100.20 16.54,44.26 17.22,43.57 C120.1
N$50
  Bottom 0.203: U100.22 15.24,43.03 C121.2
N$51
  Bottom 0.254: R146.1 LED104.A
N$52
  Bottom 0.203: R101.1 POWER_ON.A
N$55
  Top 0.254: R12.1 LED9.A
N$56
  Top 0.254: R11.1 LED8.A
N$57
  Top 0.254: R10.1 LED7.A
N$58
  Top 0.254: R7.1 LED6.A
N$59
  Top 0.254: R6.1 LED5.A
N$60
  Top 0.254: LED3.A R4.1
N$61
  Top 0.254: R5.1 LED4.A
N$62
  Top 0.254: R3.1 LED2.A
N$63
  Top 0.254: R2.1 LED1.A
OC1  (via drill 0.38)
  Top 0.203: 115.06,90.68 114.43,90.04 100.33,90.04 98.68,88.39 98.68,86.87 100.08,85.47 v100.08,77.47
  Top 0.254: 115.06,90.68 117.35,92.96 123.06,92.96 123.32,92.71 123.32,90.85 SERVO_108.1
  Bottom 0.203: v100.08,77.47 100.08,66.98 86.92,53.82
  Bottom 0.254: IC102.23 86.32,53.22 86.92,53.82
OC1'
  Bottom 0.203: IC103.33 32.65,88.45 36.9,84.2 36.9,78.4 35.1,76.6 35.1,19.3 24,8.2 17.2,8.2 16.3,7.3 13.4,7.3 12.5,6.4 12.5,5.16 SERVO_102.1
OC2  (via drill 0.6)
  Top 0.203: 106.96,90.63 113.51,90.63 115.14,92.25
  Top 0.254: v99.16,80.49 99.16,85.53 98.05,86.64 98.05,88.56 100.12,90.63 106.96,90.63 | 114.45,91.57 115.14,92.25 116.39,93.51 130.65,93.51 131.32,92.84 SERVO_107.1
  Bottom 0.203: 86.54,54.46 99.16,67.08 v99.16,80.49
  Bottom 0.254: IC102.22 85.95,53.87 86.54,54.46 | 99.12,80.45 v99.16,80.49
OC2'
  Bottom 0.203: IC103.32 31.4,90.4 37.4,84.4 37.4,78.2 35.6,76.4 35.6,19.1 24.2,7.7 22,7.7 21,6.7 21,5.16 SERVO_101.1
OC3  (via drill 0.6)
  Top 0.203: 106.77,91.33 113.29,91.33 114.27,92.31
  Top 0.254: v97.15,82.36 97.15,88.77 99.71,91.33 106.77,91.33 | 114.27,92.31 116.2,94.24 138.17,94.24 139.32,93.09 139.32,90.84 SERVO_106.1
  Bottom 0.203: 84.18,55.68 97.15,68.65 v97.15,82.36
  Bottom 0.254: IC102.21 83.94,55.44 84.18,55.68
OC3'
  Bottom 0.203: SERVO_100.1 29.6,5.16 29.6,12.4 36.1,18.9 36.1,76.2 37.9,78 37.9,84.6 31.1,91.4 29,91.4 28.95,91.35 IC103.31
OC4  (via drill 0.6)
  Top 0.203: 106.6,91.94 113.03,91.94 114.18,93.09
  Top 0.254: v95.34,83.86 95.34,87.77 99.51,91.94 106.6,91.94 | 114.01,92.92 114.18,93.09 116.08,94.99 145.8,94.99 147.57,93.22 SERVO_105.1
  Bottom 0.203: 83.55,56.51 95.34,68.3 v95.34,83.86
  Bottom 0.254: IC102.19 82.64,55.6 83.55,56.51
OC5  (via drill 0.6)
  Top 0.203: 106.34,92.79 112.97,92.79 113.82,93.64
  Top 0.254: 93.83,86.86 v93.9,86.79 93.9,87.47 99.22,92.79 106.34,92.79 | 113.82,93.64 115.81,95.63 147.32,95.63 152.4,90.55 153.67,90.55 154.56,89.66 154.56,84.71 153.54,83.69 152.31,83.69 SERVO_104.1
  Bottom 0.203: 83.28,57.34 93.9,67.96 v93.9,86.79
  Bottom 0.254: IC102.18 81.99,56.05 83.28,57.34
OC6  (via drill 0.6)
  Top 0.203: 106.28,93.5 112.71,93.5 113.61,94.4
  Top 0.254: v92.48,88.66 92.59,88.66 97.43,93.5 106.28,93.5 | 113.61,94.4 115.62,96.41 147.81,96.41 153.03,91.19 153.92,91.19 155.32,89.79 155.32,76.96 153.92,75.56 152.5,75.56 SERVO_103.1
  Bottom 0.203: 82.25,58.34 92.48,68.57 v92.48,88.66
  Bottom 0.254: 82.25,58.34 80.04,56.13 IC102.15
PGC1  (via drill 0.6)
  Top 0.254: PROGRAMMING.4 PROGRAMMING.3 96.71,34.18 95.79,35.1 95.79,40.3 v87.63,48.46
  Bottom 0.254: IC102.2 83.29,48.42 83.95,47.76 86.93,47.76 v87.63,48.46
PGD1  (via drill 0.6)
  Top 0.254: v90,48.44 90.05,48.44 96.7,41.79 96.7,36.17 97.98,34.89 PROGRAMMING.5 PROGRAMMING.6
  Bottom 0.254: IC102.1 83.94,48.87 84.44,48.37 85.82,48.37 87.11,49.66 88.78,49.66 v90,48.44
PH1
  pour Bottom: 120.33,28.26 118.11,28.26 118.11,28.89 117.47,29.53 117.47,36.2 113.03,39.37 113.03,45.72 120.33,45.72
PH2
  pour Bottom: 135.57,28.26 133.35,28.26 133.35,28.89 132.72,29.53 132.72,36.2 128.27,39.37 128.27,45.72 135.57,45.72
PH3
  pour Bottom: 150.81,28.26 148.59,28.26 148.59,28.89 147.96,29.53 147.96,36.2 144.44,39.28 144.44,45.63 150.81,45.72
PH_VM
  pour Bottom: 50.75,48.19 48.53,48.19 48.53,48.82 47.9,49.46 47.9,56.12 43.45,59.3 43.45,65.65 50.75,65.65
S1-AOUT1
  Bottom 0.203: STEP1.4 6.17,73.29 12.78,73.29 13.29,72.78 U102.4
S1-AOUT2  (via drill 0.38)
  Top 0.203: STEP1.1 10.62,64.65 v12.14,63.13
  Bottom 0.203: U102.25 13.29,64.27 v12.14,63.13
S1-BOUT1
  Bottom 0.203: STEP1.3 12.02,69.73 12.4,70.11 17.48,70.11 17.86,70.5 U102.11
S1-BOUT2
  Bottom 0.203: U102.18 17.86,66.43 17.48,66.81 12.4,66.81 11.89,67.32 5.29,67.32 STEP1.2
S1-DIR  (via drill 0.38)
  Top 0.203: v10.62,72.53 11.75,71.4 v21.1,71.4
  Bottom 0.203: v10.62,72.53 12.52,72.53 12.65,72.4 U102.3 | IC103.64 21.95,72.25 v21.1,71.4
S1-ENABLEN  (via drill 0.38)
  Top 0.203: v10.8,62.9 11.3,62.4 12.6,62.4 15.6,65.4 v22.3,65.4
  Bottom 0.203: U102.26 12.65,64.4 12.14,63.89 11.76,63.89 10.8,62.93 v10.8,62.9 | IC103.55 26.45,66.35 25.5,65.4 v22.3,65.4
S1-HOME  (via drill 0.38)
  Top 0.203: v10.49,70.5 21.5,70.5 v22.2,71.3
  Bottom 0.203: v10.49,70.5 10.75,70.24 11.76,70.24 11.99,70.47 U102.2 | IC103.63 22.45,71.55 v22.2,71.3
S1-STEP  (via drill 0.38)
  Top 0.203: v18.38,63.5 v18.37,63.51 19.29,63.51 19.3,63.5 v22.9,63.5
  Bottom 0.203: U102.19 17.2,64.68 v18.37,63.51 | IC103.53 27.45,64.55 26.4,63.5 v22.9,63.5
S2-AOUT1
  Bottom 0.203: U100.4 13.29,52.33 12.65,52.97 6.05,52.97 STEP2.4
S2-AOUT2  (via drill 0.38)
  Top 0.203: STEP2.1 10.37,44.46 v12.52,42.3
  Bottom 0.203: v12.52,42.3 12.52,43.19 13.29,43.95 U100.25
S2-BOUT1
  Bottom 0.203: U100.11 17.86,50.17 17.6,49.92 12.52,49.92 11.76,49.16 5.54,49.16 STEP2.3
S2-BOUT2
  Bottom 0.203: U100.18 17.86,46.24 17.6,46.49 12.4,46.49 11.76,47.13 5.29,47.13 STEP2.2
S2-DIR  (via drill 0.38)
  Top 0.203: v21,50.8 11.64,50.8 v10.49,51.95
  Bottom 0.203: U100.3 12.65,51.95 12.4,52.21 10.75,52.21 v10.49,51.95 | IC103.54 26.95,65.85 25.9,64.8 23.2,64.8 22.2,63.8 22.2,52 v21,50.8
S2-ENABLEN  (via drill 0.38)
  Top 0.203: v11.1,42 11.5,41.6 12.9,41.6 16.55,45.16 16.98,45.6 25,45.6 v25.4,46
  Bottom 0.203: U100.26 12.65,44.08 11.1,42.53 v11.1,42 | IC103.51 28.45,49.05 v25.4,46
S2-HOME  (via drill 0.38)
  Top 0.203: v10.37,49.92 10.49,49.8 v21,49.8
  Bottom 0.203: v10.37,49.92 11.69,49.92 11.99,50.23 U100.2 12.02,51.04 | IC103.52 27.95,63.95 22.8,58.8 22.8,51.3 21.3,49.8 v21,49.8
S2-STEP  (via drill 0.38)
  Top 0.203: v25.3,43.7 v18.37,43.7
  Bottom 0.203: U100.19 17.2,44.36 17.86,43.7 v18.37,43.7 | IC103.50 28.95,47.35 v25.3,43.7
S-SRN  (via drill 0.38)
  Top 0.203: v25.4,47.1 25.2,47.1 24.1,48.2 24.1,66.5 23.2,67.4 v22.7,67.4
  Bottom 0.203: U100.16 19.15,46.14 20.12,47.1 v25.4,47.1 | U102.16 19.15,66.46 20.1,67.4 v22.7,67.4 23.5,67.4 24.45,68.35 IC103.59
SCL  (via drill 0.38)
  Top 0.203: v27.3,85.8 27.8,85.3 32.2,85.3 v35.2,88.3 | v45.1,88.3 53.05,88.3 53.59,87.76 54.61,87.76 57.15,90.3 62.06,90.3 63.82,88.54 | 106.68,53.97 102.4,53.97 101.51,54.86
  Top 0.254: R9.1 99.56,47.87 100.83,47.87 101.85,48.89 104.66,48.89 105.56,49.8 U$5.P9.19 105.66,50.16 107.09,51.6 107.09,53.69 106.68,53.97 | 63.82,88.54 83.49,88.54 101.51,70.52 101.51,54.86
  Bottom 0.203: IC103.2 18.95,81.45 18.8,81.3 18.8,80.8 19.2,80.4 21.1,80.4 21.5,80.8 23,80.8 27.3,85.1 v27.3,85.8 | v35.2,88.3 v45.1,88.3
  Bottom 0.254: IC102.4 81.99,47.78 83.39,46.38 99.34,46.38 101.84,48.89 104.35,48.89 104.35,48.95 U$5.P9.19
SDA  (via drill 0.38)
  Top 0.203: v27.8,84.5 32.9,84.5 v36,87.6 | v46,87.6 52.99,87.6 53.47,87.12 54.99,87.12 57.66,89.79 61.6,89.79 64.99,86.4
  Top 0.254: U$5.P9.20 102.58,50.16 100.49,52.25 | 100.49,52.25 99.55,52.25 R8.1 | 64.99,86.4 84.29,86.4 100.49,70.2 100.49,52.25
  Bottom 0.203: IC103.3 18.75,81.95 18.3,81.5 18.3,80.6 19,79.9 21.3,79.9 21.7,80.3 23.2,80.3 27.4,84.5 v27.8,84.5 | v36,87.6 v46,87.6
  Bottom 0.254: IC102.3 82.64,48.23 83.73,47.14 98.89,47.14 101.75,50 102.86,50 U$5.P9.20
START_LEFT
  Top 0.254: START_SWITCH.3 80.28,31.97 R19.2
  Bottom 0.254: START_SWITCH.3 82.23,34.5 90.1,34.5 95.61,40.01 U$5.P9.12
START_RIGHT
  Top 0.254: R13.2 71.05,32.26 START_SWITCH.1
  Bottom 0.254: START_SWITCH.1 78.07,35.42 89.13,35.42 94.99,41.28 104.84,41.28 105.56,40.55 U$5.P9.11
SWITCH_1  (via drill 0.6)
  Top 0.254: v96.21,48.6 96.77,48.6 101.73,43.64 101.73,25.08 100.67,24.02 U$4.P$2 U$4.P$3 99.2,14.74 97.68,13.22 97.68,11.1 R23.1
  Bottom 0.254: IC102.27 86.37,50.62 86.76,50.23 89.77,50.23 92.23,47.77 95.38,47.77 v96.21,48.6
SWITCH_2  (via drill 0.6)
  Top 0.254: v82.52,42.25 83.43,41.34 86.61,41.34 87.36,40.59 87.36,30.45 89.37,28.44 89.37,24.92 91.45,22.84 92.49,22.84 92.84,23.19 U$3.P$2 | R22.1 91.05,11.22 91.05,13.66 92.18,14.79 U$3.P$3
  Top 0.406: U$3.P$2 U$3.P$3
  Bottom 0.254: IC102.6 80.69,44.08 v82.52,42.25
UART_RX
  Bottom 0.203: LIDAR.2 107.7,78.74 107.19,78.23 107.19,52.2 106.43,51.44 104.39,51.44 103.12,52.7 U$5.P9.22
UART_TX
  Bottom 0.203: U$5.P9.21 105.16,52.7 104.27,53.59 104.27,78.74 104.9,79.38 107.19,79.38 LIDAR.3
USM0  (via drill 0.38)
  Top 0.203: v22.5,70.4 22.6,70.5 24,70.5 25.9,68.6 v25.9,50.9
  Bottom 0.203: U100.13 19.15,50.15 20.2,49.1 24.1,49.1 v25.9,50.9 | U102.13 19.15,70.47 19.42,70.2 22.3,70.2 v22.5,70.4 22.95,70.85 IC103.62
USM1  (via drill 0.38)
  Top 0.203: v22.7,69.2 23.6,69.2 25.1,67.7 25.1,50.2 v25.7,49.6
  Bottom 0.203: U100.12 18.49,50.05 19.94,48.6 24.7,48.6 v25.7,49.6 | U102.12 18.49,70.37 19.66,69.2 v22.7,69.2 23.45,69.95 IC103.61
VCC  (via drill 0.38, 1)  (1 unrouted)
  Top 0.203: PWR_IN(2).2 49.7,12.6 v50.8,13.7
  Bottom 0.203: R101.2 v50.8,13.7 | R100.2 v133.48,13.34
  Bottom 0.254: U$106.7 116.2,32.38 v115.89,32.7 | U$105.7 131.44,32.38 v131.13,32.7 | U$104.7 146.69,32.38 v146.37,32.7 | U$107.7 46.62,52.31 v46.31,52.63
  pour Top: 115.16,19.16 115.25,33.66 118.43,33.66 118.34,19.16
  pour Bottom: 114.94,31.75 116.52,31.75 116.52,35.24 113.67,35.24 113.67,33.02
  pour Top: 130.48,19.17 130.49,33.66 133.67,33.66 133.66,19.17
  pour Bottom: 130.18,31.75 131.76,31.75 131.76,35.24 128.91,35.24 128.91,33.02
  pour Top: 145.7,19.17 145.73,33.66 148.91,33.66 148.88,19.17
  pour Bottom: 145.41,31.75 147,31.75 147,35.24 144.15,35.24 144.15,33.02
  pour Top: 141.49,11.16 143.93,11.16 148.86,16.09 148.86,19.85 114.2,19.85 121.31,11.18
  pour Bottom: 45.35,51.68 46.94,51.68 46.94,55.17 44.09,55.17 44.09,52.95
  pour Top (isolate 0.254): 43.3,10.7 49,10.7 49,53.59 45.95,53.59 45.95,16.7 43.3,14.2
VOUT1  (via drill 0.38)
  Top 0.254: R3.2 120.4,68.58 v120.9,69.09
  Bottom 0.254: R108.2 121.6,24.3 121.6,48.26 118.27,51.59 L102.2 | C127.1 120.8,61.1 R3.2
  Bottom 0.406: U103.3 | 79.95,69.89 U101.3 | R115.2 108.34,74.36 109.03,75.05 114.33,75.05
  Bottom 1.016: 120.93,68.71 R3.2
  pour Bottom: 121.92,49.21 113.35,49.21 113.35,55.24 116.2,58.1 116.2,62.55 121.92,62.55
  pour Bottom: 121.95,69.38 121.95,74.2 116.29,79.86 116.29,99.11 116.36,99.18 85.72,99.18 85.65,99.11 81.28,80.67 81.22,74.19 75.42,74.19 75.37,77.9 75.34,77.93 73.3,77.93 73.24,77.87 73.27,73.14 73.31,72.56 78.35,72.56 78.34,71.85 78.34,69.51 78.32,69.49 80.28,69.49 80.35,69.42 80.35,71.8 80.36,72.6 91.89,72.6 91.81,73.29 91.88,89.67 92.24,90.03 104.7,90.03 108.58,86.15 108.4,74.41 108.37,74.01 111.77,74.01 114.75,71.03 118.36,71.03 119,70.39 119,65.55 116.11,62.66 121.94,62.66 122.06,62.54 122.06,69.27
  pour Bottom: 78.36,69.34 83.31,69.34 83.44,69.47 83.44,73.15 83.31,73.28 78.49,73.28 78.49,69.47
VOUT2  (via drill 0.38)
  Top 0.254: R4.2 135.76,68.96 v135.89,69.09
  Bottom 0.254: R106.2 136.84,24.3 136.84,48.26 133.51,51.59 L101.2 | C126.1 136.04,61.1 R4.2
  pour Bottom: 137.16,49.21 128.59,49.21 128.59,55.24 131.44,58.1 131.4,67.56 137.63,71.71
  pour Bottom: 137.61,72.15 140.54,75.08 140.54,98.89 140.48,98.95 117.59,98.95 117.53,99.01 117.53,80.34 124.58,73.29 130.67,73.29 134.56,69.4 135.39,69.4 137.61,71.62
VOUT3  (via drill 0.38)
  Top 0.254: R5.2 152.02,68.58 v152.15,68.71
  Bottom 0.254: R104.2 152.08,24.3 152.08,48.26 148.75,51.59 L100.2 | C125.1 151.28,61.1 R5.2
  pour Bottom: 152.4,49.21 144.36,49.25 144.36,55.28 146.69,58.1 146.65,66.66 158.55,72.18
  pour Bottom: 158.5,71.72 158.59,71.72 158.59,99.39 141.28,99.39 141.28,74.65 145.06,74.65 150.84,68.87 155.65,68.87
VOUT5
  Bottom 0.406: R138.1 76.8,82.76 U103.4
  Bottom 0.508: U103.4 76.51,85.45 C151.A 76.45,90.17 | 76.45,90.17 78.87,92.58 78.87,95.73 3.3V.1 | 3.3V(2).1 73.18,93.44 75.81,90.81 | 75.81,90.81 76.45,90.17 | 3.3V1.1 67.52,93.26 69.98,90.81 | 69.98,90.81 70.1,90.81 75.81,90.81 | 3.3V(2)1.1 61.72,92.97 63.88,90.81 69.98,90.81
VSNS1
  Bottom 0.254: R108.1 R109.2 113.67,23.65 U$106.4
VSNS2
  Bottom 0.254: R106.1 R107.2 128.91,23.65 U$105.4
VSNS3
  Bottom 0.254: R104.1 R105.2 144.15,23.65 U$104.4
VSNS_VM
  Bottom 0.254: R123.1 R124.2 44.09,43.58 U$107.4

## Text on the board
bPlace: 5V
tNames: Motherboard Rev 2 , Dec 2015 / Sean Ketring , Josh Stevens | BBB Reset | PIC Reset | BBB Power Off